# Altium schematic sheet heater_control.SchDoc: Heater Control
size Tabloid; DocumentNumber: LM-003; Revision: 3.0; SheetNumber: 6; SheetTotal: 11
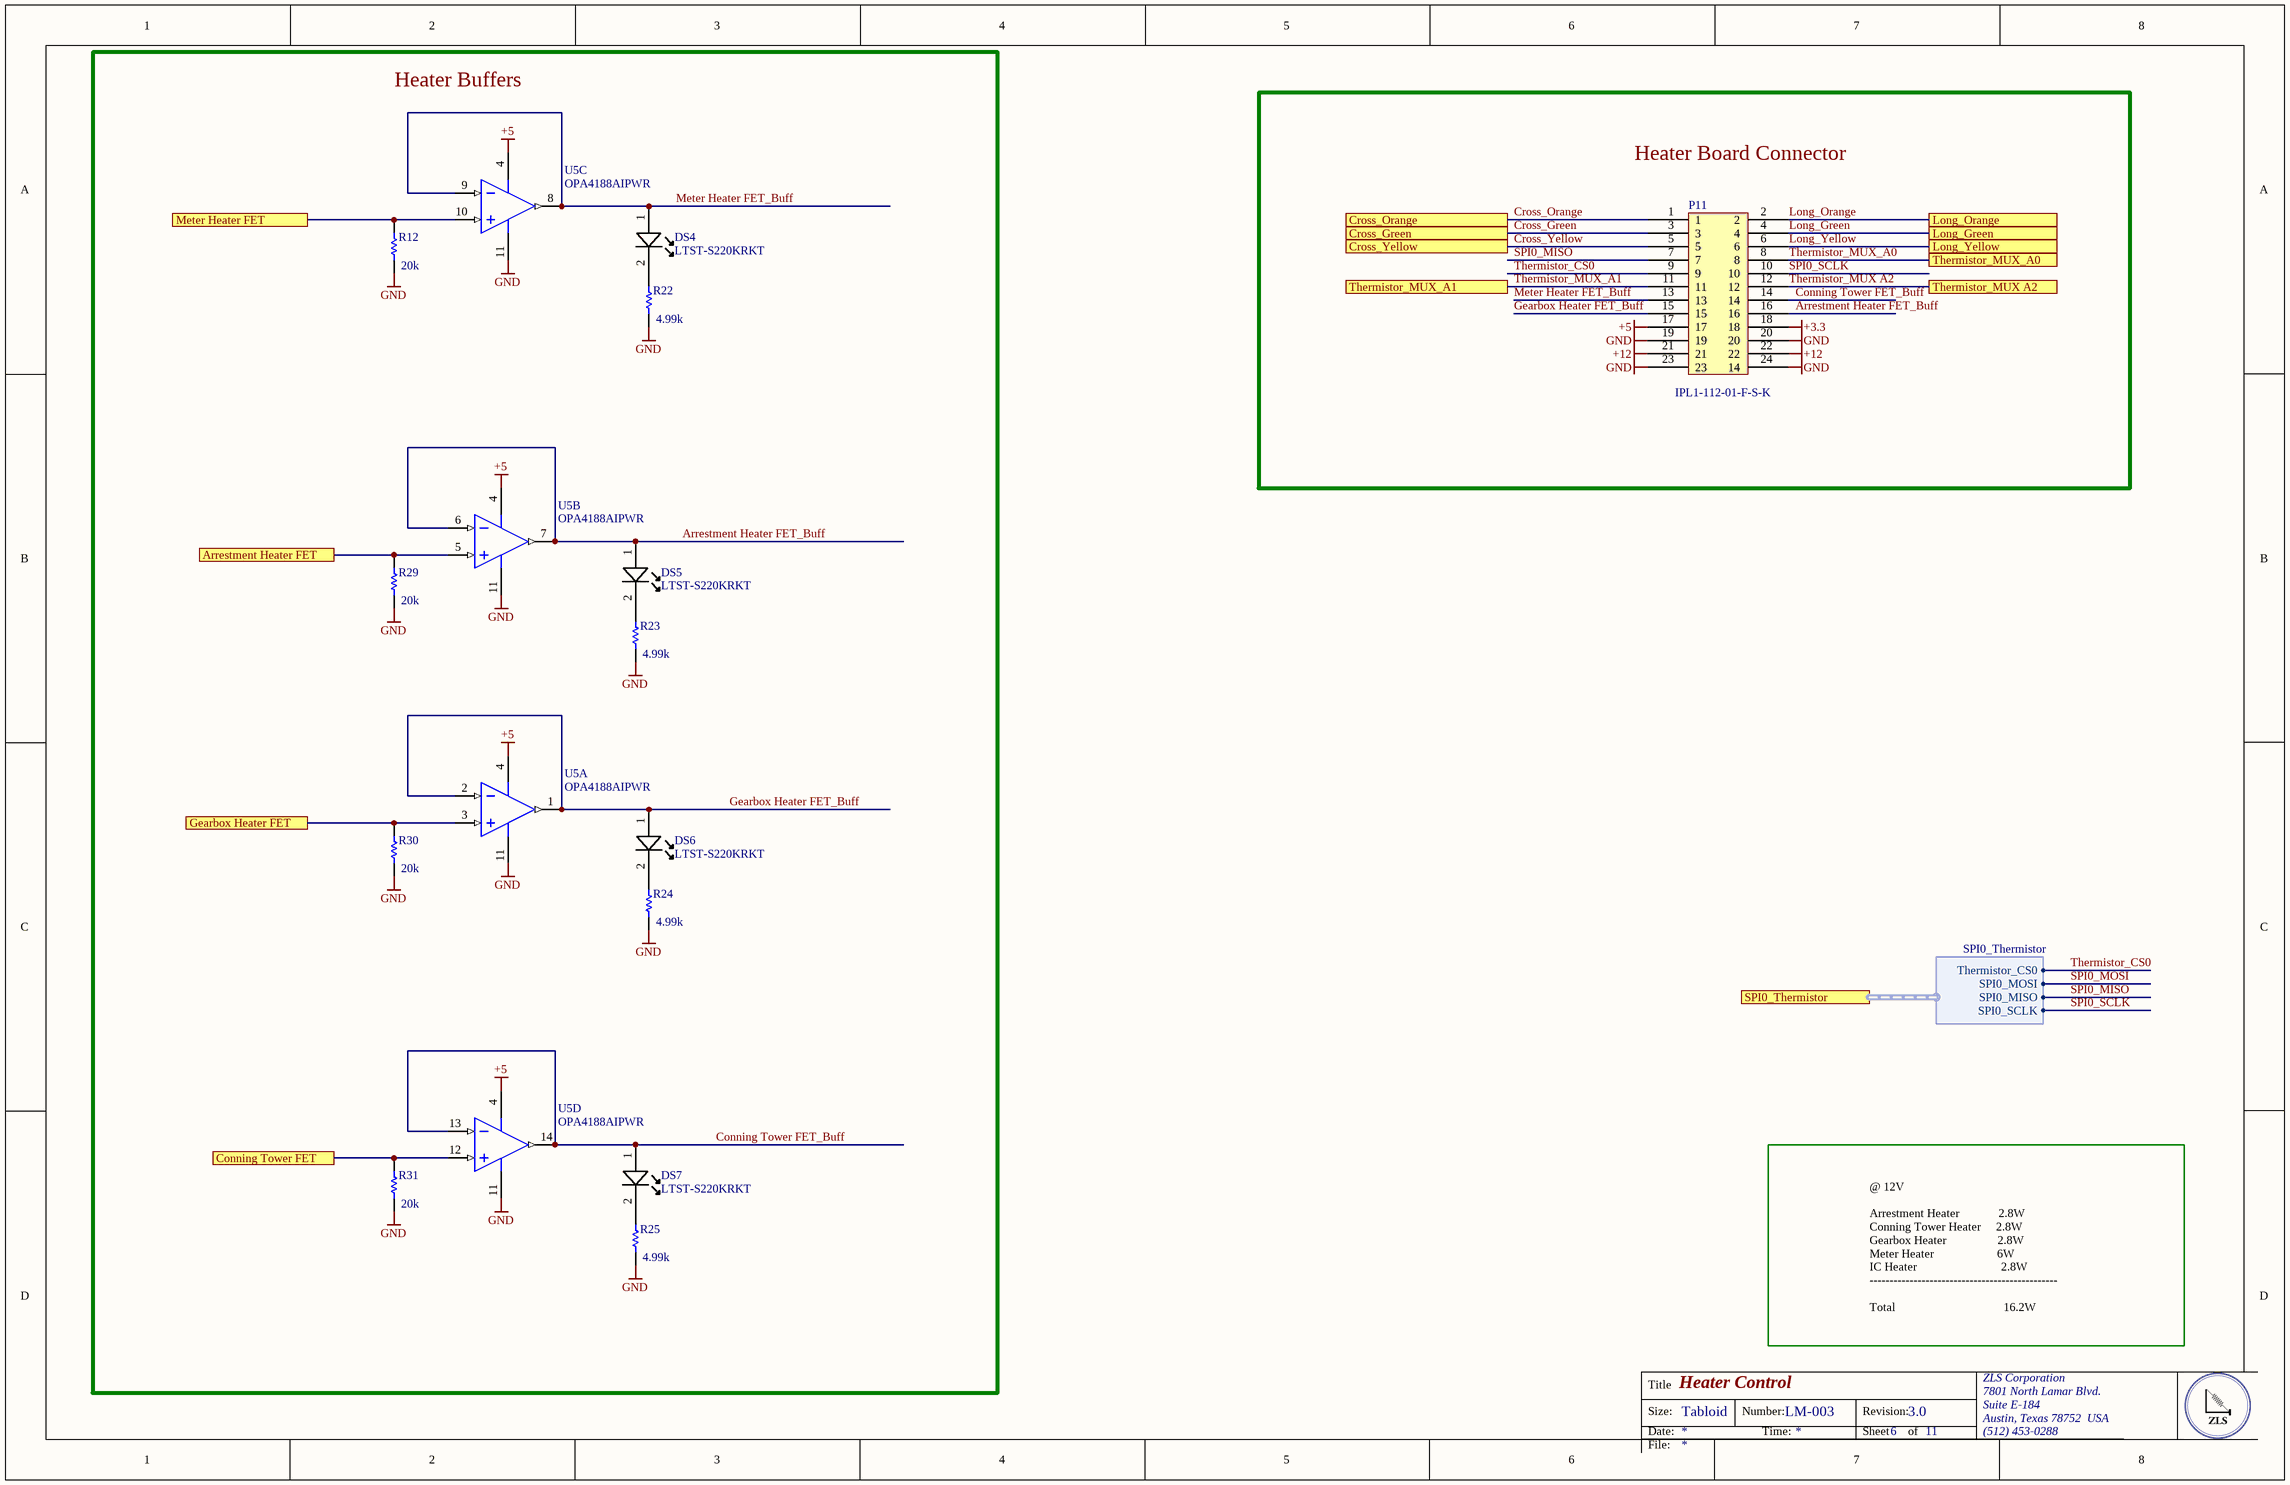
[diagram p0: heater_control.SchDoc]

## Parts
(Parts that share a designator on the sheet are numbered #1, #2 ... from top to bottom, then left to right.)
DS4  Manufacturer Part Number: LTST-S220KRKT  [0805C_L]  (hidden comment: Visible Name Value Type    False Description Lite-On LTST-S220KRKT Red LED, 631 nm 2012 (0805) Side View, Rectangle Lens SMD package STRING)
DS5  Manufacturer Part Number: LTST-S220KRKT  [0805C_L]  (hidden comment: Visible Name Value Type    False Description Lite-On LTST-S220KRKT Red LED, 631 nm 2012 (0805) Side View, Rectangle Lens SMD package STRING)
DS6  Manufacturer Part Number: LTST-S220KRKT  [0805C_L]  (hidden comment: Visible Name Value Type    False Description Lite-On LTST-S220KRKT Red LED, 631 nm 2012 (0805) Side View, Rectangle Lens SMD package STRING)
DS7  Manufacturer Part Number: LTST-S220KRKT  [0805C_L]  (hidden comment: Visible Name Value Type    False Description Lite-On LTST-S220KRKT Red LED, 631 nm 2012 (0805) Side View, Rectangle Lens SMD package STRING)
P11  IPL1-112-01-F-S-K  [IPL1-112-01-F-S-K]
R12  20k  [RESC0402(1005)_M]
R22  4.99k  [RESC0402(1005)_M]
R23  4.99k  [RESC0402(1005)_M]
R24  4.99k  [RESC0402(1005)_M]
R25  4.99k  [RESC0402(1005)_M]
R29  20k  [RESC0402(1005)_M]
R30  20k  [RESC0402(1005)_M]
R31  20k  [RESC0402(1005)_M]
U5#1  OPA4188AIPWR  [PW0014A_N]  (parts B,C of 4)
U5#2  OPA4188AIPWR  [PW0014A_N]  (parts A,D of 4)

## Blocks framed on the sheet
Heater Buffers: DS4-DS7 R12 R22-R25 R29-R31 U5#1 U5#2
Heater Board Connector: P11

## Ports
Arrestment Heater FET, Conning Tower FET, Cross_Green, Cross_Orange, Cross_Yellow, Gearbox Heater FET, Long_Green, Long_Orange, Long_Yellow, Meter Heater FET, SPI0_Thermistor (harness SPI0_Thermistor), Thermistor_MUX A2, Thermistor_MUX_A0, Thermistor_MUX_A1

## Harnesses
SPI0_Thermistor: Thermistor_CS0, SPI0_MOSI, SPI0_MISO, SPI0_SCLK

## Nets
+3.3: P11.18
+5: P11.17 U5#1.4(V+) U5#2.4(V+)
+12: P11.21 P11.22
GND: P11.19 P11.20 P11.23 P11.24(14) R12.2 R22.2 R23.2 R24.2 R25.2 R29.2 R30.2 R31.2 U5#1.11(V-) U5#2.11(V-)
Arrestment Heater FET: R29.1 U5#1.5(IN_B+) ; port Arrestment Heater FET
Arrestment Heater FET_Buff: DS5.1(A) P11.16 U5#1.6(IN_B-) U5#1.7(OUT_B)
Conning Tower FET: R31.1 U5#2.12(IN_D+) ; port Conning Tower FET
Conning Tower FET_Buff: DS7.1(A) P11.14 U5#2.13(IN_D-) U5#2.14(OUT_D)
Cross_Green: P11.3 ; port Cross_Green
Cross_Orange: P11.1 ; port Cross_Orange
Cross_Yellow: P11.5 ; port Cross_Yellow
Gearbox Heater FET: R30.1 U5#2.3(IN_A+) ; port Gearbox Heater FET
Gearbox Heater FET_Buff: DS6.1(A) P11.15 U5#2.1(OUT_A) U5#2.2(IN_A-)
Long_Green: P11.4 ; port Long_Green
Long_Orange: P11.2 ; port Long_Orange
Long_Yellow: P11.6 ; port Long_Yellow
Meter Heater FET: R12.1 U5#1.10(IN_C+) ; port Meter Heater FET
Meter Heater FET_Buff: DS4.1(A) P11.13 U5#1.8(OUT_C) U5#1.9(IN_C-)
SPI0_MISO: P11.7 ; port SPI0_Thermistor.SPI0_MISO
SPI0_MOSI: port SPI0_Thermistor.SPI0_MOSI
SPI0_SCLK: P11.10 ; port SPI0_Thermistor.SPI0_SCLK
Thermistor_CS0: P11.9 ; port SPI0_Thermistor.Thermistor_CS0
Thermistor_MUX A2: P11.12 ; port Thermistor_MUX A2
Thermistor_MUX_A0: P11.8 ; port Thermistor_MUX_A0
Thermistor_MUX_A1: P11.11 ; port Thermistor_MUX_A1
NetDS4_2: DS4.2(K) R22.1
NetDS5_2: DS5.2(K) R23.1
NetDS6_2: DS6.2(K) R24.1
NetDS7_2: DS7.2(K) R25.1

## Notes on the sheet
- @ 12V
  Arrestment Heater             2.8W
  Conning Tower Heater     2.8W
  Gearbox Heater                 2.8W
  Meter Heater                     6W
  IC Heater                            2.8W
  -----------------------------------------------
  Total                                    16.2W
- Title
- Size:
- Date:
- Tabloid
- Number:
- Time:
- Revision:
- Sheet
- of
- ZLS Corporation
- 7801 North Lamar Blvd.
- Suite E-184
- Austin, Texas 78752  USA
- (512) 453-0288
- File:

## Library data of the parts
DS4-DS7 = LED A/K: Manufacturer: Vishay / Lite-On; Lens Colour: Colorless; Lens Style: Diffused,Colorless; Viewing Angle: 130°; Luminous Intensity: 54mcd; Forward Current: 20mA; Forward Voltage: 2V; Power Rating: 75mW; Dominant Wavelength: 631nm; Lens Transparency: Clear; Number of Elements: 1; Wavelength: 639nm; Supplier 1: Digi-Key; Supplier Part Number 1: 160-1469-1-ND; Stock 1: 108191; Pricing 1: 1=0.31, 10=0.225, 25=0.1656, 100=0.1183, 250=0.0804, 500=0.071, 1000=0.0556 (USD); Mount: Surface Mount; Case/Package: 0805; Number of Pins: 2; Colour: Red; Case Code (Metric): 2012; Case Code (Imperial): 0805; Min Operating Temperature: -55°C; Max Operating Temperature: 85°C; Packaging: Tape and Reel; Package Quantity: 4000; Illumination Colour: Red; Test Current: 20mA; Power Dissipation: 75mW; Number of LEDs: 1; Length: 2.1mm; Height: 0.6mm; Width: 1mm; Depth: 0.6mm; Radiation Hardening: No; Lead Free: Lead Free; ComponentLink1URL: https://datasheet.ciiva.com/2110/s-110-ltst-s220krkt-2110132.pdf; ComponentLink1Description: https://datasheet.ciiva.com/2110/s-110-ltst-s220krkt-2110132.pdf; ComponentLink2URL: https://datasheet.ciiva.com/2110/s-110-ltst-s220krkt-2110133.pdf; ComponentLink2Description: https://datasheet.ciiva.com/2110/s-110-ltst-s220krkt-2110133.pdf; ComponentLink3URL: https://datasheet.ciiva.com/2110/s-110-ltst-s220krkt-2110134.pdf; ComponentLink3Description: https://datasheet.ciiva.com/2110/s-110-ltst-s220krkt-2110134.pdf; ComponentLink4URL: https://datasheet.ciiva.com/12403/lite-on-ltst-s220krkt-187389-12403798.pdf; ComponentLink4Description: https://datasheet.ciiva.com/12403/lite-on-ltst-s220krkt-187389-12403798.pdf; ComponentLink5URL: https://datasheet.ciiva.com/16345/lite-onltst-s220krkt-16345511.pdf; ComponentLink5Description: https://datasheet.ciiva.com/16345/lite-onltst-s220krkt-16345511.pdf; ComponentLink6URL: https://datasheet.ciiva.com/15118/getdatasheetpartid-225752-15118120.pdf; ComponentLink6Description: https://datasheet.ciiva.com/15118/getdatasheetpartid-225752-15118120.pdf; ComponentLink7URL: https://datasheet.ciiva.com/14633/0900766b80dc0b76-14633737.pdf; ComponentLink7Description: https://datasheet.ciiva.com/14633/0900766b80dc0b76-14633737.pdf; ComponentLink8URL: https://datasheet.ciiva.com/11775/0900766b80dc0b76-11775439.pdf; ComponentLink8Description: https://datasheet.ciiva.com/11775/0900766b80dc0b76-11775439.pdf
P11 = IPL1-112-01-F-S-K: IPL1-112-01-F-D-K; Manufacturer: Samtec; Number of Contacts: 12; Gender: Male; Pitch: 2.54mm; Supplier 1: Newark; Supplier Part Number 1: 08W3504; Supplier 2: Avnet; Supplier Part Number 2: IPL1-112-01-F-S-K; Manufacturer Part Number: IPL1-112-01-F-S-K; Stock 2: 0; Mount: Through Hole; Packaging: Bulk; Termination: Solder; Orientation: Straight; Radiation Hardening: No; ComponentLink1URL: https://datasheet.ciiva.com/9444/ipl1-9444389.pdf; ComponentLink1Description: https://datasheet.ciiva.com/9444/ipl1-9444389.pdf
R12 R22-R25 R29-R31 = CMP-1011-00651-1
U5#1 U5#2 = CMP-0809-00009-2: 0.03 uV/C, Low Noise, Rail-to-Rail Output, Zero-Drift Operational Amplifier, 4 to 36 V, -40 to 125 degC, 14-pin SOP (PW14), Green (RoHS & no Sb/Br); Manufacturer: Texas Instruments; Number of Channels: 4; Iq per channel(Max)(mA): 0.475; CMRR(Min)(dB): 120; GBW(Typ)(MHz): 2; Offset Drift(Typ)(uV/C): 0.03; Total Supply Voltage(Max)(+5V is 5, +/-5V is 10): 36; Rating: Catalog; Slew Rate(Typ)(V/us): 0.8; SubFamily: High Supply Voltage Amplifier (>=30V), Low Noise Amp (<=10nV/rtHz), Low Offset Voltage Amplifier (<=500uV), Low Power Amp (<=500uA), Zero Drift Precision Amplifier; ComponentLink2URL: http://www.ti.com/lit/ds/symlink/opa4188.pdf; PackageReference: PW0014A; ComponentLink3URL: http://www.ti.com/litv/pdf/mpds360; Eco-Plan: Green (RoHS & no Sb/Br); PackageVersion: 4040064-3/G, 02/2011; PartNumber: OPA4188AIPWR; ComponentLink2Description: Datasheet; DatasheetVersion: SBOS641B; Code_JEDEC: MO-153; Mounting Technology: Surface Mount; Total Supply Voltage(Min)(+5V is 5, +/-5V is 10): 4; ComponentLink1URL: http://www.ti.com/; ComponentLink3Description: Package Specification; PackageDescription: 14-Pin Plastic Small Outline, Body 5 x 4.4 mm, Pitch 0.65 mm; ComponentLink1Description: Manufacturer URL; PartId: 1